# Altium schematic sheet msxbreakout_fat.SchDoc
size B; PageSetup: Record=PageOptions|CenterHorizontal=True|CenterVertical=True|PrintScale=0.75|XCorrection=1.00|YCorrection=1.00|PrintKind=0|BorderSize=5000000|LeftOffset=0|BottomOffset=0|Orientation=2|PaperLength=1000|PaperWidth=1000|Scale=100|PaperSource=7|PrintQuality=-4|MediaType=1|DitherType=10|PaperKind=A4 210 x 297 mm|PrintScaleMode=1
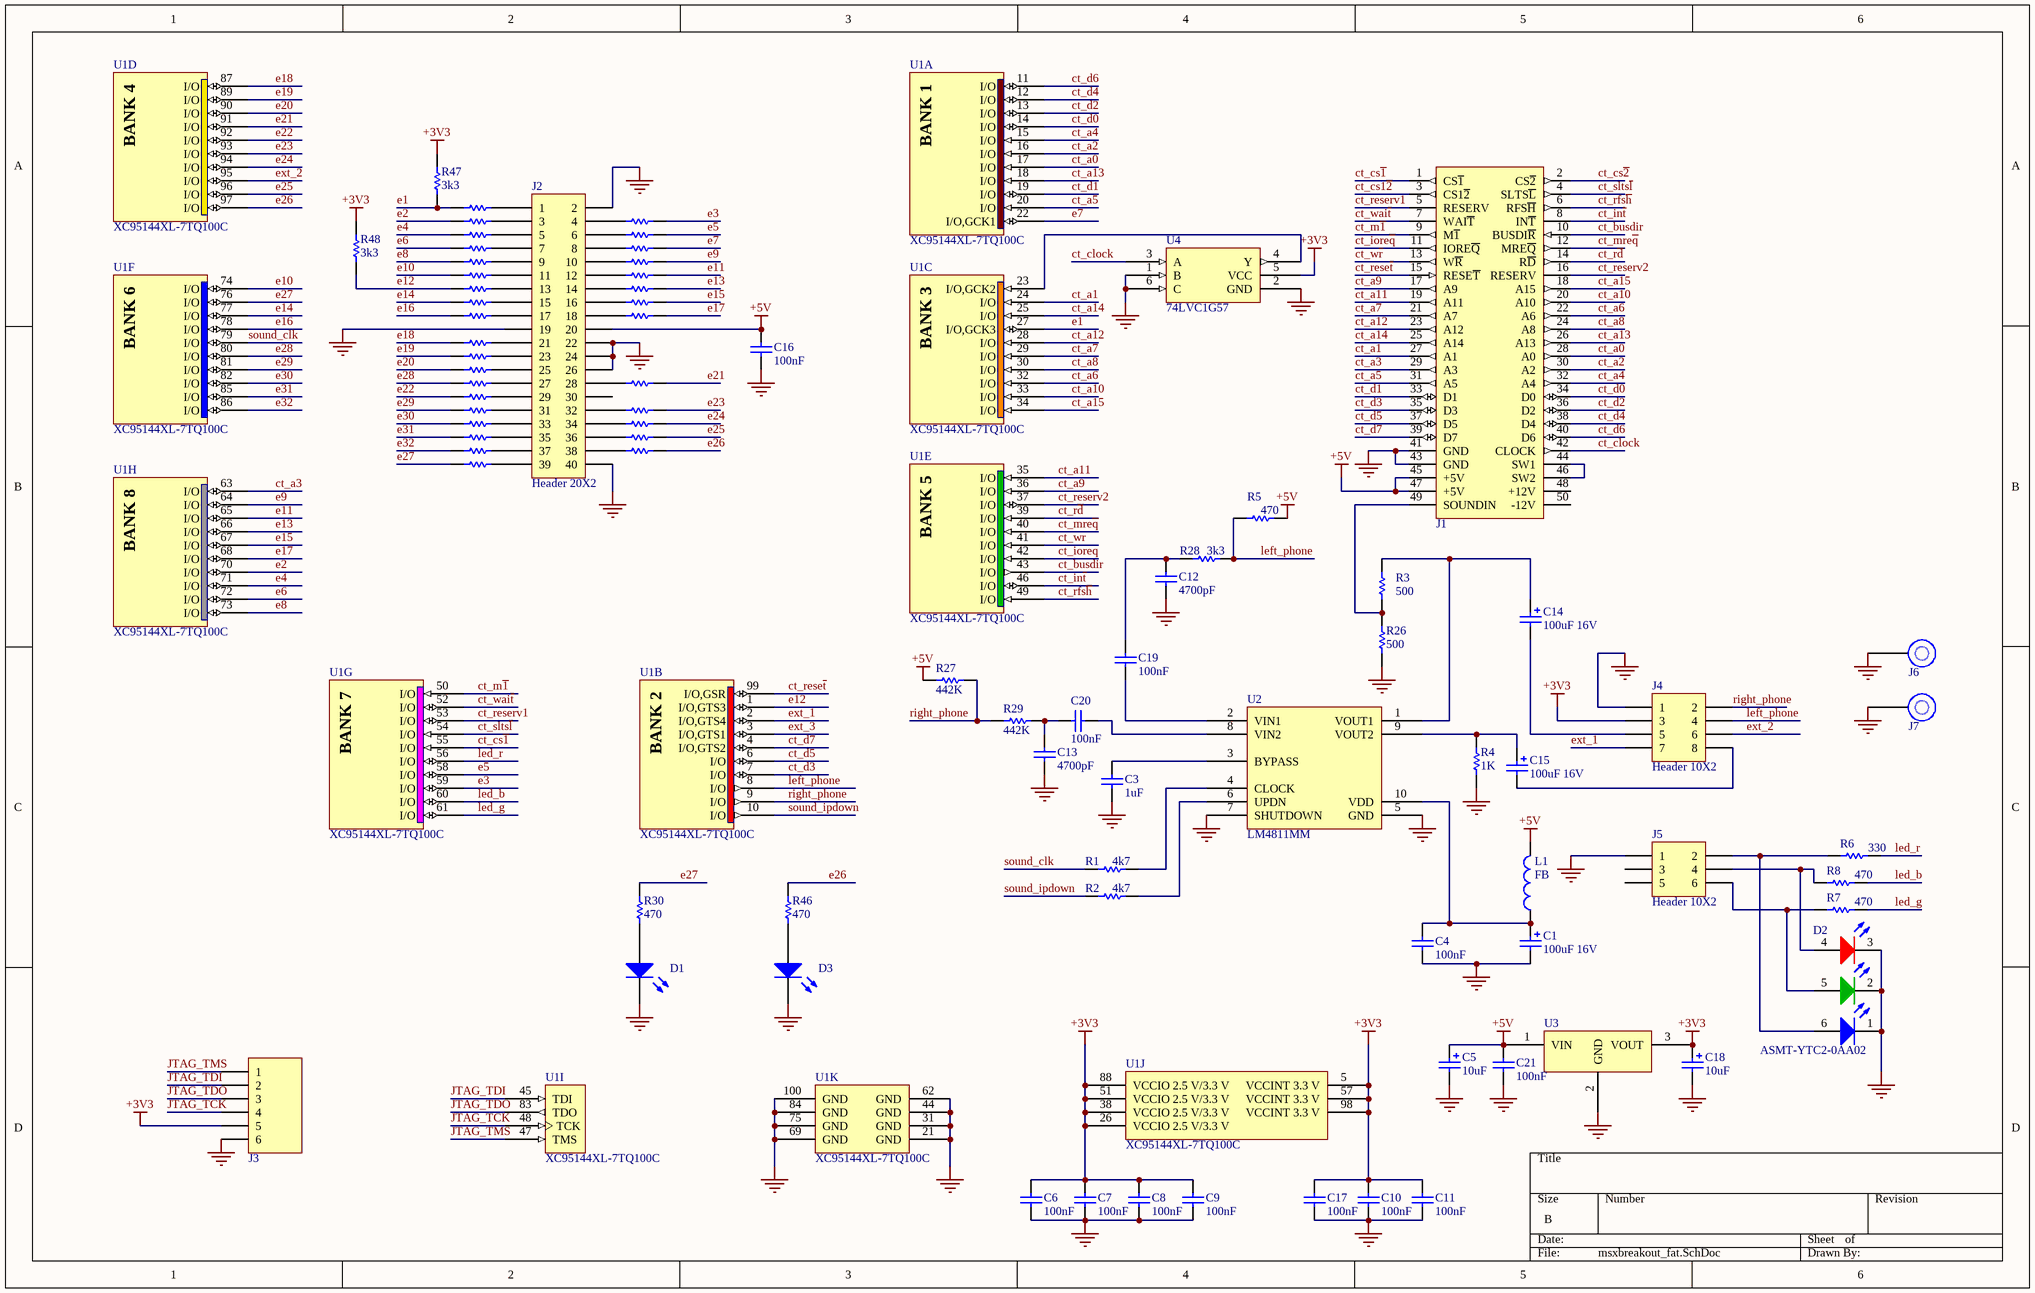
[diagram p0: msxbreakout_fat.SchDoc]

## Parts
C1  value 100uF 16V  [cap1210POL]  (hidden comment: Cap Pol1)
C3  value 1uF  [cap0603]  (hidden comment: Cap)
C4  value 100nF  [cap0603]  (hidden comment: Cap)
C5  value 10uF  [cap1210POL]  (hidden comment: Cap Pol1)
C6  value 100nF  [cap0603]  (hidden comment: Cap)
C7  value 100nF  [cap0603]  (hidden comment: Cap)
C8  value 100nF  [cap0603]  (hidden comment: Cap)
C9  value 100nF  [cap0603]  (hidden comment: Cap)
C10  value 100nF  [cap0603]  (hidden comment: Cap)
C11  value 100nF  [cap0603]  (hidden comment: Cap)
C12  value 4700pF  [cap0603]  (hidden comment: Cap)
C13  value 4700pF  [cap0603]  (hidden comment: Cap)
C14  value 100uF 16V  [cap1210POL]  (hidden comment: Cap Pol1)
C15  value 100uF 16V  [cap1210POL]  (hidden comment: Cap Pol1)
C16  value 100nF  [cap0603]  (hidden comment: Cap)
C17  value 100nF  [cap0603]  (hidden comment: Cap)
C18  value 10uF  [cap1210POL]  (hidden comment: Cap Pol1)
C19  value 100nF  [cap0603]  (hidden comment: Cap)
C20  value 100nF  [cap0603]  (hidden comment: Cap)
C21  value 100nF  [cap0603]  (hidden comment: Cap)
D1  APA1606SURCK  [LED-0603_LAMP_BLUE]  (value not drawn)
D2  ASMT-YTC2-0AA02  [ASMT-YTC2-0AA02]
D3  APA1606SURCK  [LED-0603_LAMP_RED]  (value not drawn)
J1  msxcart  [msxcart]  (value not drawn)
J2  Header 20X2  [HDR2X20_90]
J3  Header 1X6  [HDR1X6_90]  (value not drawn)
J4  Header 10X2  [HDR2X4_90]
J5  Header 10X2  [HDR2X3_90]
J6  MountHole  [MOUNTHOLE]  (value not drawn)
J7  MountHole  [MOUNTHOLE]  (value not drawn)
L1  value FB  [ind1206]  (hidden comment: Inductor)
R1  value 4k7  [res0603]  (hidden comment: Res1)
R2  value 4k7  [res0603]  (hidden comment: Res1)
R3  value 500  [res0603]  (hidden comment: Res1)
R4  value 1K  [res0603]  (hidden comment: Res1)
R5  value 470  [res0603]  (hidden comment: Res1)
R6  value 330  [res0603]  (hidden comment: Res1)
R7  value 470  [res0603]  (hidden comment: Res1)
R8  value 470  [res0603]  (hidden comment: Res1)
R9  Res1  [res0603]  (value not drawn)
R10  Res1  [res0603]  (value not drawn)
R11  Res1  [res0603]  (value not drawn)
R12  Res1  [res0603]  (value not drawn)
R13  Res1  [res0603]  (value not drawn)
R14  Res1  [res0603]  (value not drawn)
R15  Res1  [res0603]  (value not drawn)
R16  Res1  [res0603]  (value not drawn)
R17  Res1  [res0603]  (value not drawn)
R18  Res1  [res0603]  (value not drawn)
R19  Res1  [res0603]  (value not drawn)
R20  Res1  [res0603]  (value not drawn)
R21  Res1  [res0603]  (value not drawn)
R22  Res1  [res0603]  (value not drawn)
R23  Res1  [res0603]  (value not drawn)
R24  Res1  [res0603]  (value not drawn)
R25  Res1  [res0603]  (value not drawn)
R26  value 500  [res0603]  (hidden comment: Res1)
R27  value 442K  [res0603]  (hidden comment: Resistor)
R28  value 3k3  [res0603]  (hidden comment: Res1)
R29  value 442K  [res0603]  (hidden comment: Resistor)
R30  value 470  [res0603]  (hidden comment: Res1)
R31  Res1  [res0603]  (value not drawn)
R32  Res1  [res0603]  (value not drawn)
R33  Res1  [res0603]  (value not drawn)
R34  Res1  [res0603]  (value not drawn)
R35  Res1  [res0603]  (value not drawn)
R36  Res1  [res0603]  (value not drawn)
R37  Res1  [res0603]  (value not drawn)
R38  Res1  [res0603]  (value not drawn)
R39  Res1  [res0603]  (value not drawn)
R40  Res1  [res0603]  (value not drawn)
R41  Res1  [res0603]  (value not drawn)
R42  Res1  [res0603]  (value not drawn)
R43  Res1  [res0603]  (value not drawn)
R44  Res1  [res0603]  (value not drawn)
R45  Res1  [res0603]  (value not drawn)
R46  value 470  [res0603]  (hidden comment: Res1)
R47  value 3k3  [res0603]  (hidden comment: Res1)
R48  value 3k3  [res0603]  (hidden comment: Res1)
U1  XC95144XL-7TQ100C  [TQ100_M]  (parts A,B,C,D,E,F,G,H,I,J,K of 11)
U2  LM4811MM  [LM4811MM]
U3  Regulator 3V3  [sot223_4]  (value not drawn)
U4  74LVC1G57  [SOT-363 PKG]

## Nets
+3V3: C6.2 C7.2 C8.2 C9.2 C10.2 C11.2 C17.2 C18.1 J3.5 J4.3 R47.2 R48.2 U1.5(VCCINT_3.3_V) U1.26(VCCIO_2.5_V/3.3_V) U1.38(VCCIO_2.5_V/3.3_V) U1.51(VCCIO_2.5_V/3.3_V) U1.57(VCCINT_3.3_V) U1.88(VCCIO_2.5_V/3.3_V) U1.98(VCCINT_3.3_V) U3.3(VOUT) U4.5(VCC)
+5V: C5.1 C16.2 C21.2 J1.45(+5V) J1.47(+5V) J2.20 L1.2 R5.2 R27.1 U3.1(VIN)
GND: C1.2 C3.2 C4.1 C5.2 C6.1 C7.1 C8.1 C9.1 C10.1 C11.1 C12.2 C13.2 C16.1 C17.1 C18.2 C21.1 D1.2(K) D2.1 D2.2 D2.3 D3.2(K) J1.41(GND) J1.43(GND) J2.2 J2.19 J2.22 J2.24 J2.26 J2.40 J3.6 J4.1 J5.1 J6.1 J7.1 R4.1 R26.1 U1.21(GND) U1.31(GND) U1.44(GND) U1.62(GND) U1.69(GND) U1.75(GND) U1.84(GND) U1.100(GND) U2.5(GND) U2.7(SHUTDOWN) U3.2(GND) U4.1(B) U4.2(GND) U4.6(C)
ct_a0: J1.28(A0) U1.17(I/O)
ct_a1: J1.27(A1) U1.24(I/O)
ct_a2: J1.30(A2) U1.16(I/O)
ct_a3: J1.29(A3) U1.63(I/O)
ct_a4: J1.32(A4) U1.15(I/O)
ct_a5: J1.31(A5) U1.20(I/O)
ct_a6: J1.22(A6) U1.32(I/O)
ct_a7: J1.21(A7) U1.29(I/O)
ct_a8: J1.24(A8) U1.30(I/O)
ct_a9: J1.17(A9) U1.36(I/O)
ct_a10: J1.20(A10) U1.33(I/O)
ct_a11: J1.19(A11) U1.35(I/O)
ct_a12: J1.23(A12) U1.28(I/O)
ct_a13: J1.26(A13) U1.18(I/O)
ct_a14: J1.25(A14) U1.25(I/O)
ct_a15: J1.18(A15) U1.34(I/O)
ct_busdir: J1.10(BUSDI~{R}) U1.43(I/O)
ct_clock: J1.42(CLOCK) U4.3(A)
ct_cs~{1}: J1.1(CS~{1}) U1.55(I/O)
ct_cs~{2}: J1.2(CS~{2})
ct_cs1~{2}: J1.3(CS1~{2})
ct_d0: J1.34(D0) U1.14(I/O)
ct_d1: J1.33(D1) U1.19(I/O)
ct_d2: J1.36(D2) U1.13(I/O)
ct_d3: J1.35(D3) U1.7(I/O)
ct_d4: J1.38(D4) U1.12(I/O)
ct_d5: J1.37(D5) U1.6(I/O)
ct_d6: J1.40(D6) U1.11(I/O)
ct_d7: J1.39(D7) U1.4(I/O,GTS2)
ct_in~{t}: J1.8(IN~{T}) U1.46(I/O)
ct_iore~{q}: J1.11(IORE~{Q}) U1.42(I/O)
ct_m~{1}: J1.9(M~{1}) U1.50(I/O)
ct_mre~{q}: J1.12(MRE~{Q}) U1.40(I/O)
ct_r~{d}: J1.14(R~{D}) U1.39(I/O)
ct_reserv1: J1.5(RESERV) U1.53(I/O)
ct_reserv2: J1.16(RESERV) U1.37(I/O)
ct_rese~{t}: J1.15(RESE~{T}) U1.99(I/O,GSR)
ct_rfs~{h}: J1.6(RFS~{H}) U1.49(I/O)
ct_slts~{l}: J1.4(SLTS~{L}) U1.54(I/O)
ct_wai~{t}: J1.7(WAI~{T}) U1.52(I/O)
ct_w~{r}: J1.13(W~{R}) U1.41(I/O)
e1: R9.1 R47.1 U1.27(I/O,GCK3)
e2: R11.1 U1.70(I/O)
e3: R10.2 U1.59(I/O)
e4: R13.1 U1.71(I/O)
e5: R12.2 U1.58(I/O)
e6: R15.1 U1.72(I/O)
e7: R14.2 U1.22(I/O,GCK1)
e8: R18.1 U1.73(I/O)
e9: R16.2 U1.64(I/O)
e10: R20.1 U1.74(I/O)
e11: R17.2 U1.65(I/O)
e12: R22.1 R48.1 U1.1(I/O,GTS3)
e13: R19.2 U1.66(I/O)
e14: R24.1 U1.77(I/O)
e15: R21.2 U1.67(I/O)
e16: R25.1 U1.78(I/O)
e17: R23.2 U1.68(I/O)
e18: R31.1 U1.87(I/O)
e19: R32.1 U1.89(I/O)
e20: R33.1 U1.90(I/O)
e21: R34.2 U1.91(I/O)
e22: R36.1 U1.92(I/O)
e23: R39.2 U1.93(I/O)
e24: R37.2 U1.94(I/O)
e25: R41.2 U1.96(I/O)
e26: R43.2 R46.2 U1.97(I/O)
e27: R30.2 R45.1 U1.76(I/O)
e28: R35.1 U1.80(I/O)
e29: R38.1 U1.81(I/O)
e30: R40.1 U1.82(I/O)
e31: R42.1 U1.85(I/O)
e32: R44.1 U1.86(I/O)
ext_1: J4.7 U1.2(I/O,GTS4)
ext_2: J4.6 U1.95(I/O)
ext_3: U1.3(I/O,GTS1)
JTAG_TCK: J3.4 U1.48(TCK)
JTAG_TDI: J3.2 U1.45(TDI)
JTAG_TDO: J3.3 U1.83(TDO)
JTAG_TMS: J3.1 U1.47(TMS)
led_b: R8.2 U1.60(I/O)
led_g: R7.2 U1.61(I/O)
led_r: R6.2 U1.56(I/O)
left_phone: J4.4 R5.1 R28.2 U1.8(I/O)
right_phone: J4.2 R27.2 R29.1 U1.9(I/O)
sound_clk: R1.1 U1.79(I/O)
sound_ipdown: R2.1 U1.10(I/O)
NetC1_1: C1.1 C4.2 L1.1 U2.10(VDD)
NetC3_1: C3.1 U2.3(BYPASS)
NetC12_1: C12.1 C19.2 R28.1
NetC13_1: C13.1 C20.2 R29.2
NetC14_1: C14.1 R3.2 U2.1(VOUT1)
NetC14_2: C14.2 J4.5
NetC15_1: C15.1 R4.2 U2.9(VOUT2)
NetC15_2: C15.2 J4.8
NetC19_1: C19.1 U2.2(VIN1)
NetC20_1: C20.1 U2.8(VIN2)
NetD1_1: D1.1(A) R30.1
NetD2_4: D2.4 J5.4 R8.1
NetD2_5: D2.5 J5.6 R7.1
NetD2_6: D2.6 J5.2 R6.1
NetD3_1: D3.1(A) R46.1
NetJ1_44: J1.44(SW1) J1.46(SW2)
NetJ1_49: J1.49(SOUNDIN) R3.1 R26.2
NetJ2_1: J2.1 R9.2
NetJ2_3: J2.3 R11.2
NetJ2_4: J2.4 R10.1
NetJ2_5: J2.5 R13.2
NetJ2_6: J2.6 R12.1
NetJ2_7: J2.7 R15.2
NetJ2_8: J2.8 R14.1
NetJ2_9: J2.9 R18.2
NetJ2_10: J2.10 R16.1
NetJ2_11: J2.11 R20.2
NetJ2_12: J2.12 R17.1
NetJ2_13: J2.13 R22.2
NetJ2_14: J2.14 R19.1
NetJ2_15: J2.15 R24.2
NetJ2_16: J2.16 R21.1
NetJ2_17: J2.17 R25.2
NetJ2_18: J2.18 R23.1
NetJ2_21: J2.21 R31.2
NetJ2_23: J2.23 R32.2
NetJ2_25: J2.25 R33.2
NetJ2_27: J2.27 R35.2
NetJ2_28: J2.28 R34.1
NetJ2_29: J2.29 R36.2
NetJ2_31: J2.31 R38.2
NetJ2_32: J2.32 R39.1
NetJ2_33: J2.33 R40.2
NetJ2_34: J2.34 R37.1
NetJ2_35: J2.35 R42.2
NetJ2_36: J2.36 R41.1
NetJ2_37: J2.37 R44.2
NetJ2_38: J2.38 R43.1
NetJ2_39: J2.39 R45.2
NetR1_2: R1.2 U2.4(CLOCK)
NetR2_2: R2.2 U2.6(UPDN)
NetU1_23: U1.23(I/O,GCK2) U4.4(Y)

Not connected (* = marked no-connect by the designer): J1 48(+12V) 50(-12V); J2 30; J5 3 5

## Notes on the sheet
- (in symbol XC95144XL-7TQ100C, part A) BANK 1
- (in symbol XC95144XL-7TQ100C, part B) BANK 2
- (in symbol XC95144XL-7TQ100C, part C) BANK 3
- (in symbol XC95144XL-7TQ100C, part D) BANK 4
- (in symbol XC95144XL-7TQ100C, part E) BANK 5
- (in symbol XC95144XL-7TQ100C, part F) BANK 6
- (in symbol XC95144XL-7TQ100C, part G) BANK 7
- (in symbol XC95144XL-7TQ100C, part H) BANK 8

## Library data of the parts
C1 C5 C14 C15 C18 = Cap Pol1: Polarized Capacitor; Published: 8-Jun-2000; LatestRevisionDate: 17-Jul-2002; LatestRevisionNote: Re-released for DXP Platform.; PackageReference: RB7.6-15; Publisher: Altium Limited
C3 C4 C6-C13 C16 C17 C19-C21 = Cap: Capacitor; Published: 8-Jun-2000; LatestRevisionDate: 17-Jul-2002; LatestRevisionNote: Re-released for DXP Platform.; PackageReference: RAD-0.3; Publisher: Altium Limited
D1 D3 = APA1606SURCK: 1.6x0.6mm RIGHT ANGLE SMD CHIP LED LAMP, Hyper Red; #Parts: APA1606SURCK; Supplier 1: Digi-Key; Supplier Part Number 1: 754-1054-1-ND
D2 = ASMT-YTC2-0AA02: Typical RED, GREEN, YELLOW, AMBER GaAs LED; Published: 8-Jun-2000; LatestRevisionDate: 17-Jul-2002; LatestRevisionNote: Re-released for DXP Platform.; PackageDocument: Feb-2002; PackageReference: 3.2X1.6X1.1; Publisher: Altium Limited
J2 = Header 20X2: Header, 40-Pin, Dual row
J3 = Header 1X6: Header, 6-Pin, Single row
J4 = Header 4X2: Header, 8 -Pin, Dual row
J5 = Header 3X2: Header, 10-Pin, Dual row
J6 J7 = MountHole: Mounting hole
L1 = Inductor: Code_IEC: 1005; Published: 8-Jun-2000; LatestRevisionDate: 17-Jul-2002; LatestRevisionNote: Re-released for DXP Platform.; PackageReference: 0402-A; Publisher: Altium Limited; Code_JEITA: 0402
R1-R8 R26 R28 R30 R46-R48 = Res1: Resistor; Published: 8-Jun-2000; LatestRevisionDate: 17-Jul-2002; LatestRevisionNote: Re-released for DXP Platform.; PackageReference: AXIAL-0.3; Publisher: Altium Limited
R9-R25 R31-R45 = Res1: Resistor; Value: 442K; Published: 8-Jun-2000; LatestRevisionDate: 17-Jul-2002; LatestRevisionNote: Re-released for DXP Platform.; PackageReference: AXIAL-0.3; Publisher: Altium Limited
U1 = XC95144XL-7TQ100C: FastFLASH XC900XL, 3.3V High-Performance 144 Macrocell CPLD, 81 User I/Os, 100-Pin TQFP, Speed Grade 7, Commercial Grade; DatasheetVersion: ver2.0, Apr-2007; PackageVersion: ver1.2, Jun-2004; PackageReference: TQ100; PackageDescription: 100-Pin Thin Quad Flat Pack (TQ100); ComponentLink1Description: Manufacturer URL; ComponentLink1URL: http://www.xilinx.com/; ComponentLink2Description: XC95144XL Datasheet; ComponentLink2URL: http://www.xilinx.com/support/documentation/data_sheets/ds056.pdf; ComponentLink3Description: TQ100 Package Drawing; ComponentLink3URL: http://www.xilinx.com/support/documentation/package_specs/tq100.pdf; ComponentLink4Description: XC9500XL Documents; ComponentLink4URL: http://www.xilinx.com/support/documentation/xc9500xl.htm
R27 R29 = Resistor: Published: 8-Jun-2000; LatestRevisionDate: 17-Jul-2002; LatestRevisionNote: Re-released for DXP Platform.; PackageReference: AXIAL-0.3; Publisher: Altium Limited